# Altium project PIC12F675_ADC_PWM.PrjPcb
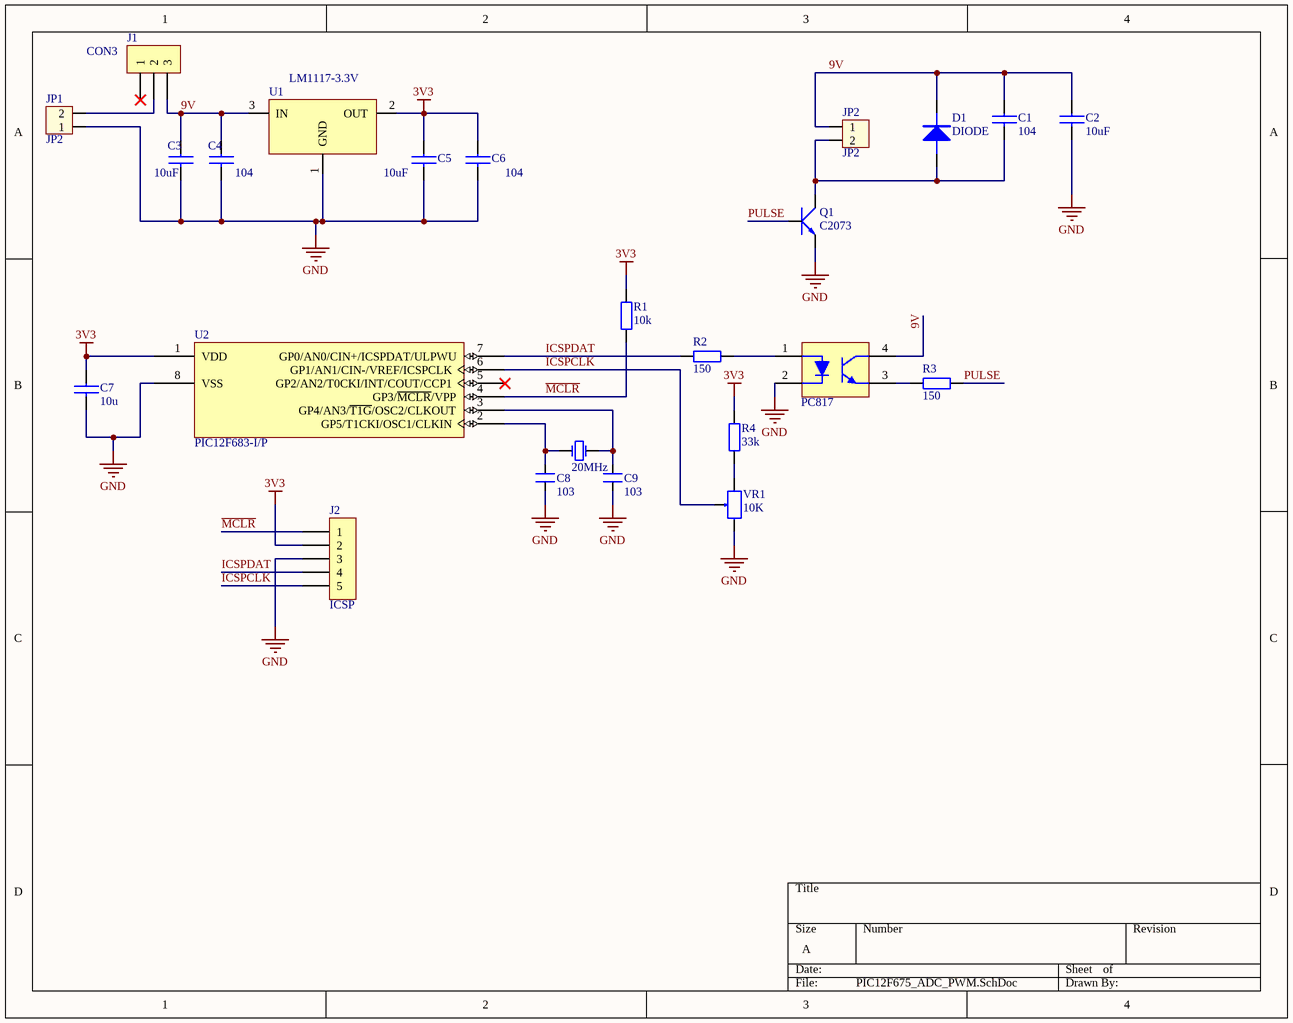
[diagram p0: PIC12F675_ADC_PWM.SchDoc]
1 sheet, 24 parts. Net scope: global (net labels, ports and power ports of the same name join across sheets).
Board files: PIC12F675_ADC_PWM.PcbDoc, PIC12F675_ADC_PWM-Multi.PcbDoc

## Sheet PIC12F675_ADC_PWM.SchDoc
size A

### Parts
C1  104  [0805]
C2  10uF  [0805]
C3  10uF  [0805]
C4  104  [0805]
C5  10uF  [0805]
C6  104  [0805]
C7  10u  [0805]
C8  103  [CN1.5]
C9  103  [CN1.5]
D1  DIODE  [DIODE/NOM/0.5A]
J1  CON3  [CON3]
J2  ICSP  [con5]
JP1  JP2  [CON2]
JP2  JP2  [CON2]
P1  PC817  [DIP-4]
Q1  C2073  [QTO-92]
R1  10k  [0805]
R2  150  [0805]
R3  150  [0805]
R4  33k  [0805]
U1  LM1117-3.3V  [SOT223-4N]
U2  PIC12F683-I/P  [PDIP300-P8]
VR1  10K  [VR]
Y1  20MHz  [XT2]

### Nets
3V3: C5.1 C6.1 C7.1 J2.2 R1.2 R4.2 U1.2(OUT) U2.1(VDD)
GND: C2.2 C3.2 C4.2 C5.2 C6.2 C7.2 C8.1 C9.1 J2.3 JP1.1 P1.2 Q1.1(E) U1.1(GND) U2.8(VSS) VR1.1
9V: C1.1 C2.1 C3.1 C4.1 D1.2 J1.3 JP2.1 P1.4 U1.3(IN)
ICSPCLK: J2.5 U2.6(GP1/AN1/CIN-/VREF/ICSPCLK) VR1.2
ICSPDAT: J2.4 R2.1 U2.7(GP0/AN0/CIN+/ICSPDAT/ULPWU)
~{MCLR}: J2.1 R1.1 U2.4(GP3/~{MCLR}/VPP)
PULSE: Q1.3(B) R3.2
NetC1_2: C1.2 D1.1 JP2.2 Q1.2(C)
NetC8_2: C8.2 U2.2(GP5/T1CKI/OSC1/CLKIN) Y1.1(OSC1)
NetC9_2: C9.2 U2.3(GP4/AN3/~{T1G}/OSC2/CLKOUT) Y1.2(OSC2)
NetJ1_2: J1.2 JP1.2
NetP1_1: P1.1 R2.2
NetP1_3: P1.3 R3.1
NetR4_1: R4.1 VR1.3

Not connected (* = marked no-connect by the designer): J1 1*; U2 5(GP2/AN2/T0CKI/INT/COUT/CCP1)*

### Library data of the parts
C1-C7 = CAP 0805: Right: 20; Bottom: 10
C8 C9 = CN1.5: Cap np 682pF => 104pF; Value: 0.01uF
J1 = CON3: Connector
J2 = CON5: Connector
JP1 JP2 = CON2: Connector 2; Value: Connector 2
P1 = PC817: NPN PHOTO General Purpose Amplifier; Published: 8-Jun-2000; LatestRevisionDate: 15-Jan-2003; LatestRevisionNote: PCB Footprint 'BCY-W3/D4.7' replaced; DatasheetDocument: 1997; PackageReference: TO-92A; Publisher: Altium Limited; Code_JEDEC: TO-92A
Q1 = C1815: NPN 600mW, ECB; Value: C1815
R1-R4 = R1/4W: Resistor 1/4W; Value: R1/4W - 1K
U1 = LM1117_1: 800mA Low-Dropout Linear Regulator; Creator: Nguyen Ba Bien; Website: http://group3i.net
U2 = PIC12F683-I/P: Flash-Based 8-Bit CMOS Microcontroller with nanoWatt Technology, 2K (x14-Bit words) Program Memory, 384 Bytes Data Memory, 8-Pin PDIP, Industrial Temperature; Manufacturer: Microchip; DatasheetVersion: revD, Feb-2007; PackageVersion: revBB, Aug-2009; PackageReference: PDIP300-P8; PackageDescription: 8-Lead Plastic Dual In-Line (P) - 300 mil Body [PDIP]; Code_JEDEC: MS-001; PartNumber: PIC12F683-I/P; ComponentLink1Description: Manufacturer URL; ComponentLink1URL: http://www.microchip.com/; ComponentLink2Description: Datasheet; ComponentLink2URL: http://ww1.microchip.com/downloads/en/DeviceDoc/41211D_.pdf; ComponentLink3Description: Package Specification; ComponentLink3URL: http://www.microchip.com/stellent/groups/techpub_sg/documents/packagingspec/en012702.pdf
VR1 = Var Resitor: Var Resistor; Value: VR 10K
Y1 = Crystal: Crystal Oscillator; Published: 8-Jun-2000; LatestRevisionDate: 17-Jul-2002; LatestRevisionNote: Re-released for DXP Platform.; PackageReference: R38; Publisher: Altium Limited